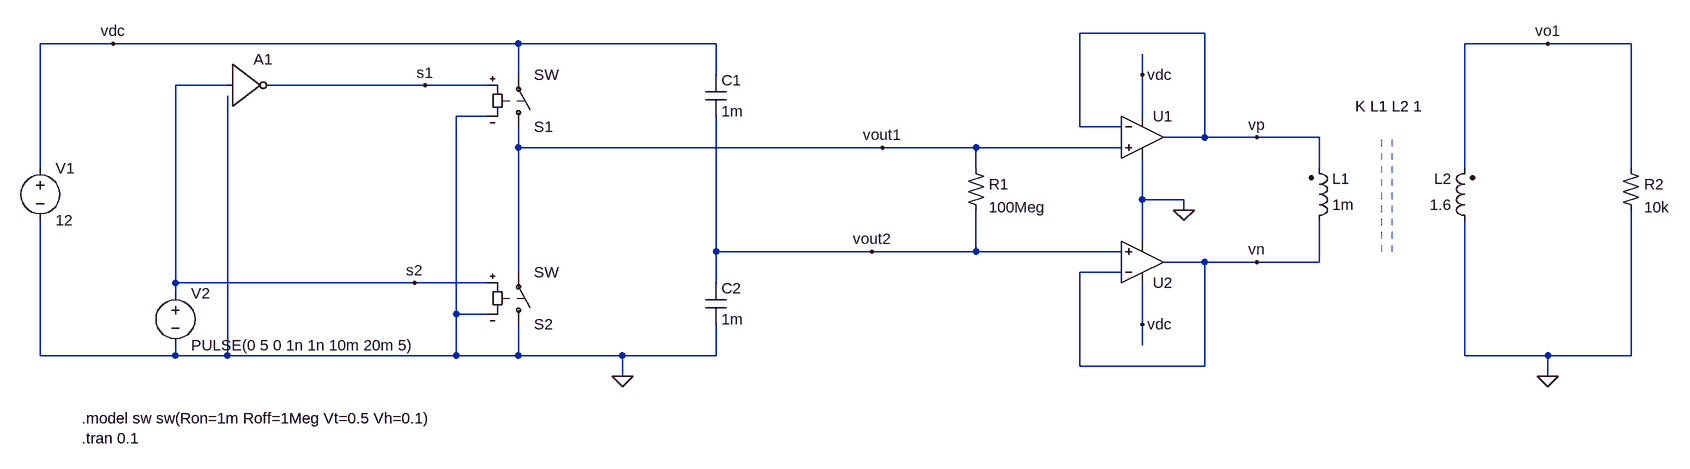
[diagram p0: schematic single-phase-inverter_v0p1.asc]
single-phase-inverter_v0p1.asc, the LTspice schematic file:
Version 4
SHEET 1 2192 716
WIRE 1424 64 1232 64
WIRE -256 80 -368 80
WIRE 368 80 -256 80
WIRE 672 80 368 80
WIRE 1952 80 1824 80
WIRE 2080 80 1952 80
WIRE 368 128 368 80
WIRE 672 128 672 80
WIRE 1328 128 1328 96
WIRE -80 144 -160 144
WIRE 224 144 -16 144
WIRE 320 144 224 144
WIRE 320 192 272 192
WIRE 1328 192 1328 128
WIRE 1232 208 1232 64
WIRE 1296 208 1232 208
WIRE 1424 224 1424 64
WIRE 1424 224 1360 224
WIRE 1504 224 1424 224
WIRE 1600 224 1504 224
WIRE 368 240 368 208
WIRE 928 240 368 240
WIRE 1072 240 928 240
WIRE 1296 240 1072 240
WIRE -368 272 -368 80
WIRE 1072 272 1072 240
WIRE 1600 272 1600 224
WIRE 1824 272 1824 80
WIRE 2080 272 2080 80
WIRE 1328 320 1328 256
WIRE 1392 320 1328 320
WIRE 1392 336 1392 320
WIRE 1328 384 1328 320
WIRE 672 400 672 192
WIRE 912 400 672 400
WIRE 1072 400 1072 336
WIRE 1072 400 912 400
WIRE 1296 400 1072 400
WIRE 1424 416 1360 416
WIRE 1504 416 1424 416
WIRE 1600 416 1600 352
WIRE 1600 416 1504 416
WIRE 368 432 368 240
WIRE 1296 432 1232 432
WIRE -160 448 -160 144
WIRE 208 448 -160 448
WIRE 320 448 208 448
WIRE 672 448 672 400
WIRE -160 464 -160 448
WIRE 272 496 272 192
WIRE 320 496 272 496
WIRE 1328 512 1328 448
WIRE 1328 544 1328 512
WIRE -368 560 -368 352
WIRE -160 560 -160 544
WIRE -160 560 -368 560
WIRE -80 560 -80 160
WIRE -80 560 -160 560
WIRE 272 560 272 496
WIRE 272 560 -80 560
WIRE 368 560 368 512
WIRE 368 560 272 560
WIRE 528 560 368 560
WIRE 672 560 672 512
WIRE 672 560 528 560
WIRE 1824 560 1824 352
WIRE 1952 560 1824 560
WIRE 2080 560 2080 336
WIRE 2080 560 1952 560
WIRE 1232 576 1232 432
WIRE 1424 576 1424 416
WIRE 1424 576 1232 576
WIRE 528 592 528 560
WIRE 1952 592 1952 560
FLAG 224 144 s1
FLAG 208 448 s2
FLAG -256 80 vdc
FLAG 928 240 vout1
FLAG 912 400 vout2
FLAG 528 592 0
FLAG 1328 128 vdc
FLAG 1952 80 vo1
FLAG 1504 224 vp
FLAG 1504 416 vn
FLAG 1328 512 vdc
FLAG 1392 336 0
FLAG 1952 592 0
SYMBOL sw 368 224 M180
SYMATTR InstName S1
SYMATTR SpiceModel sw
SYMBOL sw 368 528 M180
SYMATTR InstName S2
SYMATTR SpiceModel sw
SYMBOL cap 656 128 R0
SYMATTR InstName C1
SYMATTR Value 1m
SYMATTR SpiceLine Rser=1m Rpar=10Meg
SYMBOL cap 656 448 R0
SYMATTR InstName C2
SYMATTR Value 1m
SYMATTR SpiceLine Rser=1m Rpar=10Meg
SYMBOL voltage -368 256 R0
SYMATTR InstName V1
SYMATTR Value 12
SYMATTR SpiceLine Rser=1m
SYMBOL res2 1056 272 R0
SYMATTR InstName R1
SYMATTR Value 100Meg
SYMBOL voltage -160 448 R0
SYMATTR InstName V2
SYMATTR Value PULSE(0 5 0 1n 1n 10m 20m 5)
SYMBOL Digital/inv -80 80 R0
WINDOW 3 8 54 Left 2
SYMATTR InstName A1
SYMATTR SpiceLine VHIGH = 5
SYMBOL OpAmps/UniversalOpAmp 1328 224 R0
SYMATTR InstName U1
SYMBOL ind2 1584 368 M180
WINDOW 0 36 80 Left 2
WINDOW 3 36 40 Left 2
SYMATTR InstName L1
SYMATTR Value 1m
SYMATTR SpiceLine Rser=1m
SYMBOL ind2 1840 368 R180
WINDOW 0 36 80 Left 2
WINDOW 3 36 40 Left 2
SYMATTR InstName L2
SYMATTR Value 1.6
SYMATTR SpiceLine Rser=1m
SYMBOL res2 2064 272 R0
SYMATTR InstName R2
SYMATTR Value 10k
SYMBOL OpAmps/UniversalOpAmp 1328 416 M180
SYMATTR InstName U2
TEXT -304 656 Left 2 !.model sw sw(Ron=1m Roff=1Meg Vt=0.5 Vh=0.1)\n.tran 0.1
TEXT 1656 176 Left 2 !K L1 L2 1
LINE Normal 1696 228 1696 400 2
LINE Normal 1712 228 1712 400 2

The netlist it stands for:
* single-phase-inverter_v0p1.asc
S1 vout1 vdc s1 0 sw SW
S2 0 vout1 s2 0 sw SW
C1 vdc vout2 1m Rser=1m Rpar=10Meg
C2 vout2 0 1m Rser=1m Rpar=10Meg
V1 vdc 0 12 Rser=1m
R1 vout1 vout2 100Meg
V2 s2 0 PULSE(0 5 0 1n 1n 10m 20m 5)
A1 s2 0 0 0 0 s1 0 0 BUF VHIGH = 5
XU1 vout1 vp vdc 0 vp level1 Avol=1Meg GBW=10Meg Vos=0 En=0 Enk=0 In=0 Ink=0 Rin=500Meg  ; pins In+ In- V+ V- OUT
L1 vn vp 1m Rser=1m
L2 0 vo1 1.6 Rser=1m
R2 vo1 0 10k
XU2 vout2 vn vdc 0 vn level1 Avol=1Meg GBW=10Meg Vos=0 En=0 Enk=0 In=0 Ink=0 Rin=500Meg  ; pins In+ In- V+ V- OUT
.model sw sw(Ron=1m Roff=1Meg Vt=0.5 Vh=0.1)
.tran 0.1
K L1 L2 1
.lib UniversalOpAmp1.lib
.backanno
.end